# EAGLE design logic (EAGLE 9.6.2)
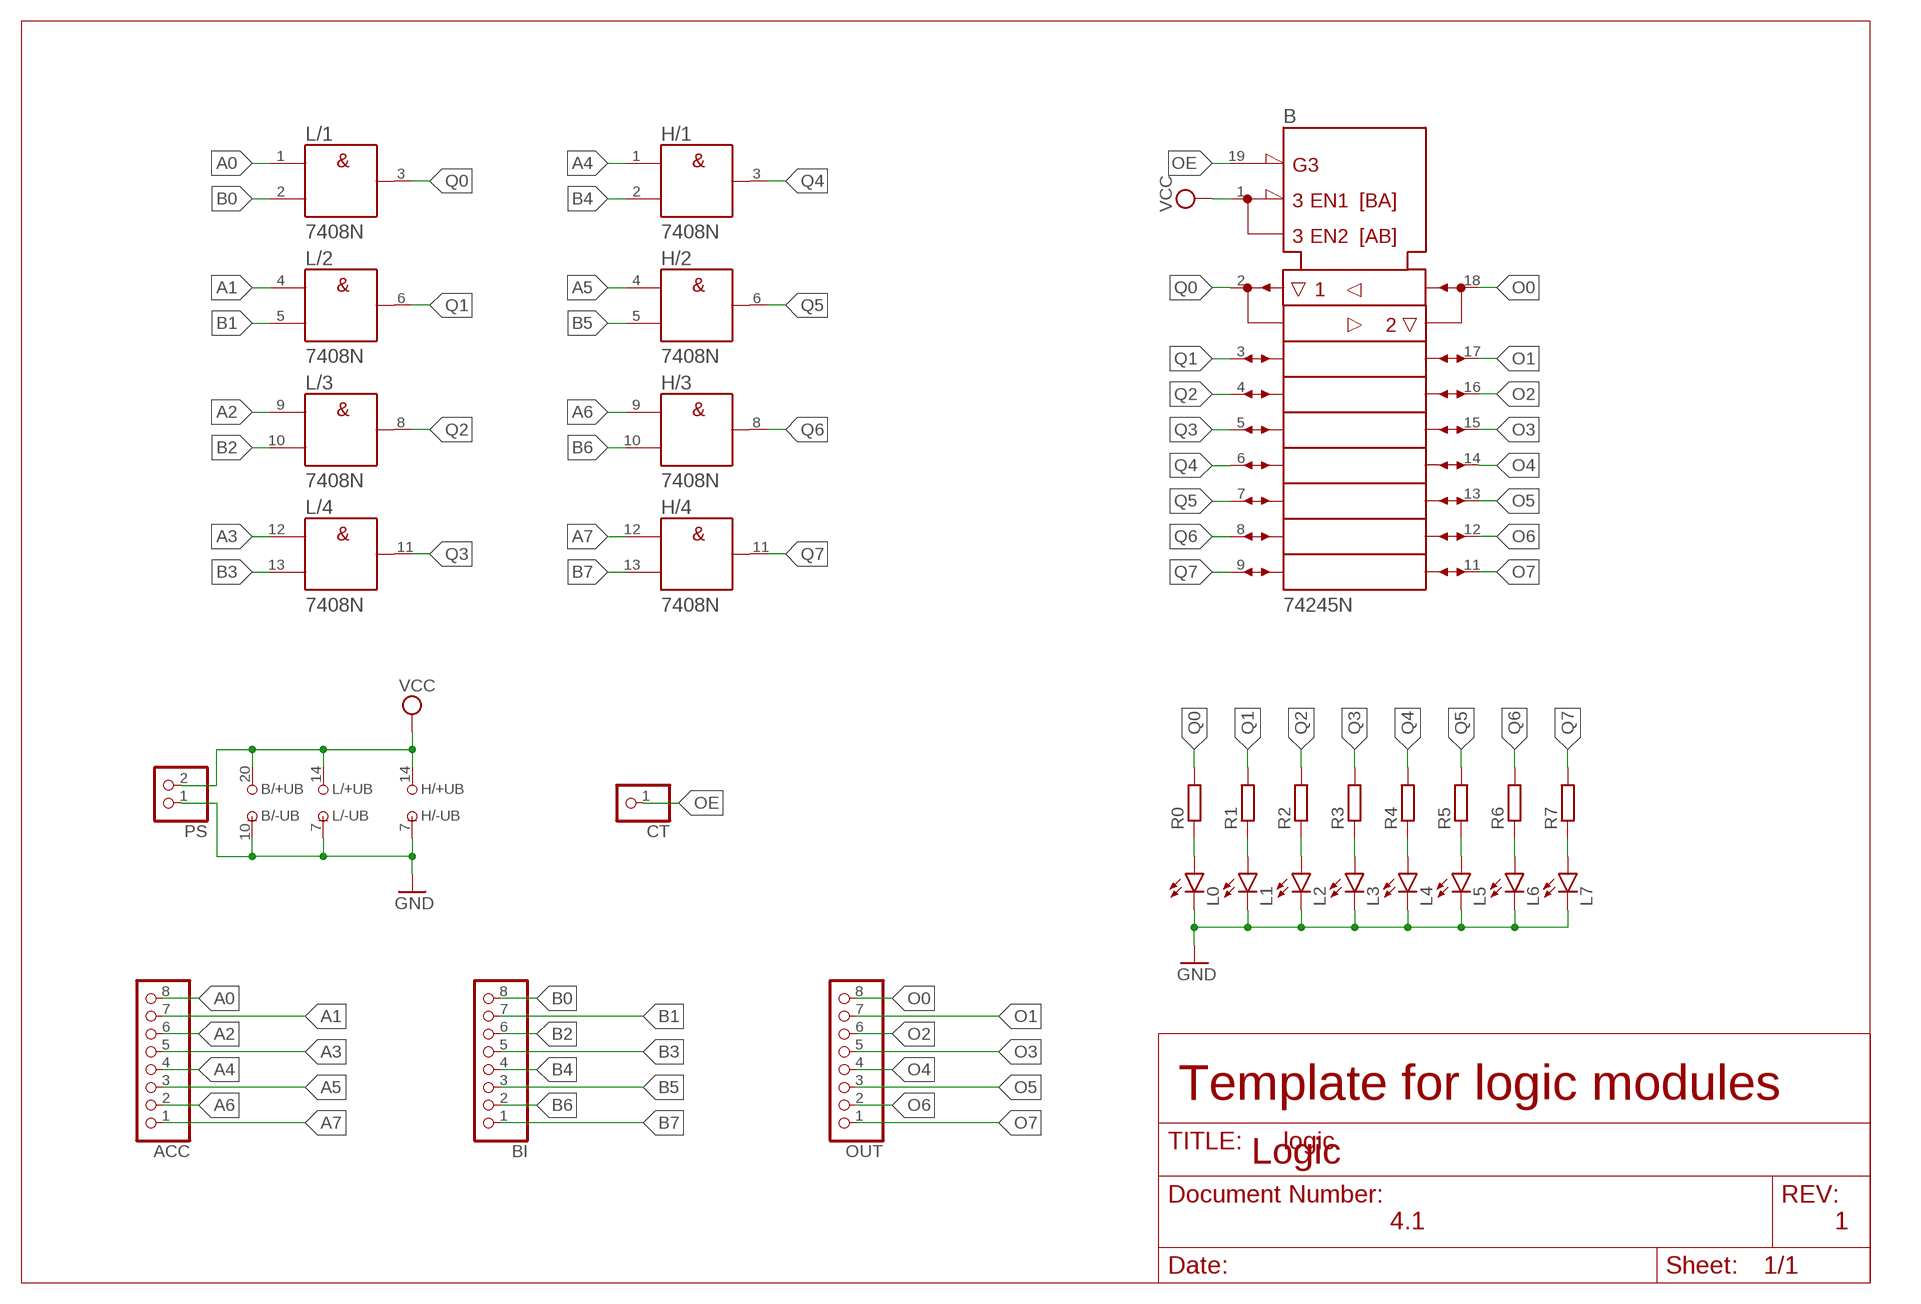
[diagram p0: schematic, sheet 1]

## Parts
ACC  PINHD-1X8  [1X08]
B  74245N  [DIL20]
BI  PINHD-1X8  [1X08]
CT  PINHD-1X1  [1X01]
H  7408N  [DIL14]
L  7408N  [DIL14]
L0  LED5MM  [LED5MM]
L1  LED5MM  [LED5MM]
L2  LED5MM  [LED5MM]
L3  LED5MM  [LED5MM]
L4  LED5MM  [LED5MM]
L5  LED5MM  [LED5MM]
L6  LED5MM  [LED5MM]
L7  LED5MM  [LED5MM]
OUT  PINHD-1X8  [1X08]
PS  PINHD-1X2  [1X02]
R0  R-EU_0204/7  [0204/7]
R1  R-EU_0204/7  [0204/7]
R2  R-EU_0204/7  [0204/7]
R3  R-EU_0204/7  [0204/7]
R4  R-EU_0204/7  [0204/7]
R5  R-EU_0204/7  [0204/7]
R6  R-EU_0204/7  [0204/7]
R7  R-EU_0204/7  [0204/7]

## Nets
A0: ACC.8 L.1(/1:A)
A1: ACC.7 L.4(/2:A)
A2: ACC.6 L.9(/3:A)
A3: ACC.5 L.12(/4:A)
A4: ACC.4 H.1(/1:A)
A5: ACC.3 H.4(/2:A)
A6: ACC.2 H.9(/3:A)
A7: ACC.1 H.12(/4:A)
B0: BI.8 L.2(/1:B)
B1: BI.7 L.5(/2:B)
B2: BI.6 L.10(/3:B)
B3: BI.5 L.13(/4:B)
B4: BI.4 H.2(/1:B)
B5: BI.3 H.5(/2:B)
B6: BI.2 H.10(/3:B)
B7: BI.1 H.13(/4:B)
GND: B.10(-UB) H.7(/-UB:-UB) L0.K(C) L1.K(C) L2.K(C) L3.K(C) L4.K(C) L5.K(C) L6.K(C) L7.K(C) L.7(/-UB:-UB) PS.1
N$1: L0.A R0.1
N$4: L1.A R1.1
N$7: L2.A R2.1
N$10: L3.A R3.1
N$13: L4.A R4.1
N$16: L5.A R5.1
N$19: L6.A R6.1
N$22: L7.A R7.1
O0: B.18(B1) OUT.8
O1: B.17(B2) OUT.7
O2: B.16(B3) OUT.6
O3: B.15(B4) OUT.5
O4: B.14(B5) OUT.4
O5: B.13(B6) OUT.3
O6: B.12(B7) OUT.2
O7: B.11(B8) OUT.1
OE: B.19(!G) CT.1
Q0: B.2(A1) L.3(/1:Y) R0.2
Q1: B.3(A2) L.6(/2:Y) R1.2
Q2: B.4(A3) L.8(/3:Y) R2.2
Q3: B.5(A4) L.11(/4:Y) R3.2
Q4: B.6(A5) H.3(/1:Y) R4.2
Q5: B.7(A6) H.6(/2:Y) R5.2
Q6: B.8(A7) H.8(/3:Y) R6.2
Q7: B.9(A8) H.11(/4:Y) R7.2
VCC: B.1(DIR) B.20(+UB) H.14(/+UB:+UB) L.14(/+UB:+UB) PS.2

## Notes on the sheet
- Template for logic modules
- Logic
- 4.1 | 1

## Library data of the parts
ACC BI OUT = pinhead:PINHD-1X8: PIN HEADER
B = 74ttl-din:74*245: Octal BUS TRANSCEIVER, 3-state
CT = pinhead:PINHD-1X1: PIN HEADER
H L = 74ttl-din:74*08: Quad 2-input AND gate
L0 L1-L7 = led:LED: LED OSRAM: - CHIPLED LG R971, LG N971, LY N971, LG Q971, LY Q971, LO R971, LY R971 LH N974, LH R974 LS Q976, LO Q976, LY Q976 LO Q996 - Hyper CHIPLED LW Q18S LB Q993, LB Q99A, LB R99A - SideLED LS A670, LO A670, LY A670, LG A670, LP A670 LB A673, LV A673, LT A673, LW A673 LH A674 LY A675 LS A676, LA A676, LO A676, LY A676, LW A676 LS A679, LY A679, LG A679 - Hyper Micro SIDELED® LS Y876, LA Y876, LO Y876, LY Y876 LT Y87S - SmartLED LW L88C, LW L88S LB L89C, LB L89S, LG L890 LS L89K, LO L89K, LY L89K LS L896, LA L896, LO L896, LY L896 - TOPLED LS T670, LO T670, LY T670, LG T670, LP T670 LSG T670, LSP T670, LSY T670, LOP T670, LYG T670 LG T671, LOG T671, LSG T671 LB T673, LV T673, LT T673, LW T673 LH T674 LS T676, LA T676, LO T676, LY T676, LB T676, LH T676, LSB T676, LW T676 LB T67C, LV T67C, LT T67C, LS T67K, LO T67K, LY T67K, LW E67C LS E67B, LA E67B, LO E67B, LY E67B, LB E67C, LV E67C, LT E67C LW T67C LS T679, LY T679, LG T679 LS T770, LO T770, LY T770, LG T770, LP T770 LB T773, LV T773, LT T773, LW T773 LH T774 LS E675, LA E675, LY E675, LS T675 LS T776, LA T776, LO T776, LY T776, LB T776 LHGB T686 LT T68C, LB T68C - Hyper Mini TOPLED® LB M676 - Mini TOPLED Santana® LG M470 LS M47K, LO M47K, LY M47K Source: http://www.osram.convergy.de LUXEON: - LUMILED® LXK2-PW12-R00, LXK2-PW12-S00, LXK2-PW14-U00, LXK2-PW14-V00 LXK2-PM12-R00, LXK2-PM12-S00, LXK2-PM14-U00 LXK2-PE12-Q00, LXK2-PE12-R00, LXK2-PE12-S00, LXK2-PE14-T00, LXK2-PE14-U00 LXK2-PB12-K00, LXK2-PB12-L00, LXK2-PB12-M00, LXK2-PB14-N00, LXK2-PB14-P00, LXK2-PB14-Q00 LXK2-PR12-L00, LXK2-PR12-M00, LXK2-PR14-Q00, LXK2-PR14-R00 LXK2-PD12-Q00, LXK2-PD12-R00, LXK2-PD12-S00 LXK2-PH12-R00, LXK2-PH12-S00 LXK2-PL12-P00, LXK2-PL12-Q00, LXK2-PL12-R00 Source: www.luxeon.com KINGBRIGHT: KA-3528ASYC Source: www.kingbright.com
PS = pinhead:PINHD-1X2: PIN HEADER
R0 R1-R7 = rcl:R-EU_: RESISTOR, European symbol; SPICEPREFIX: R

## Board
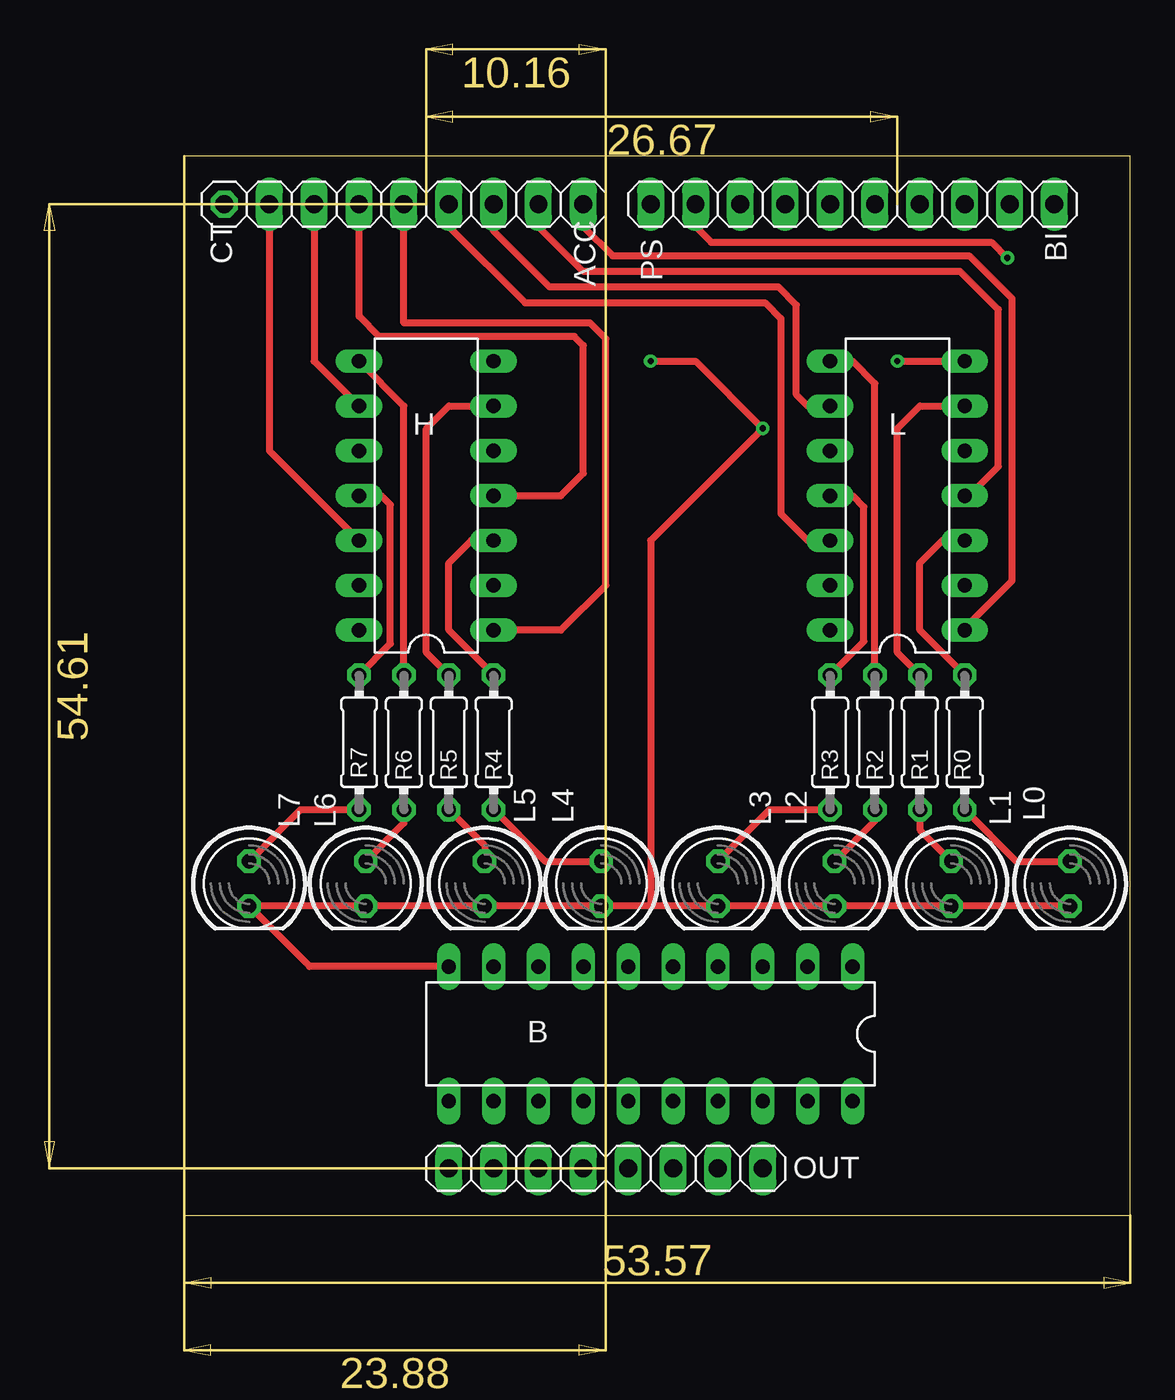
[diagram p1: board, top side]
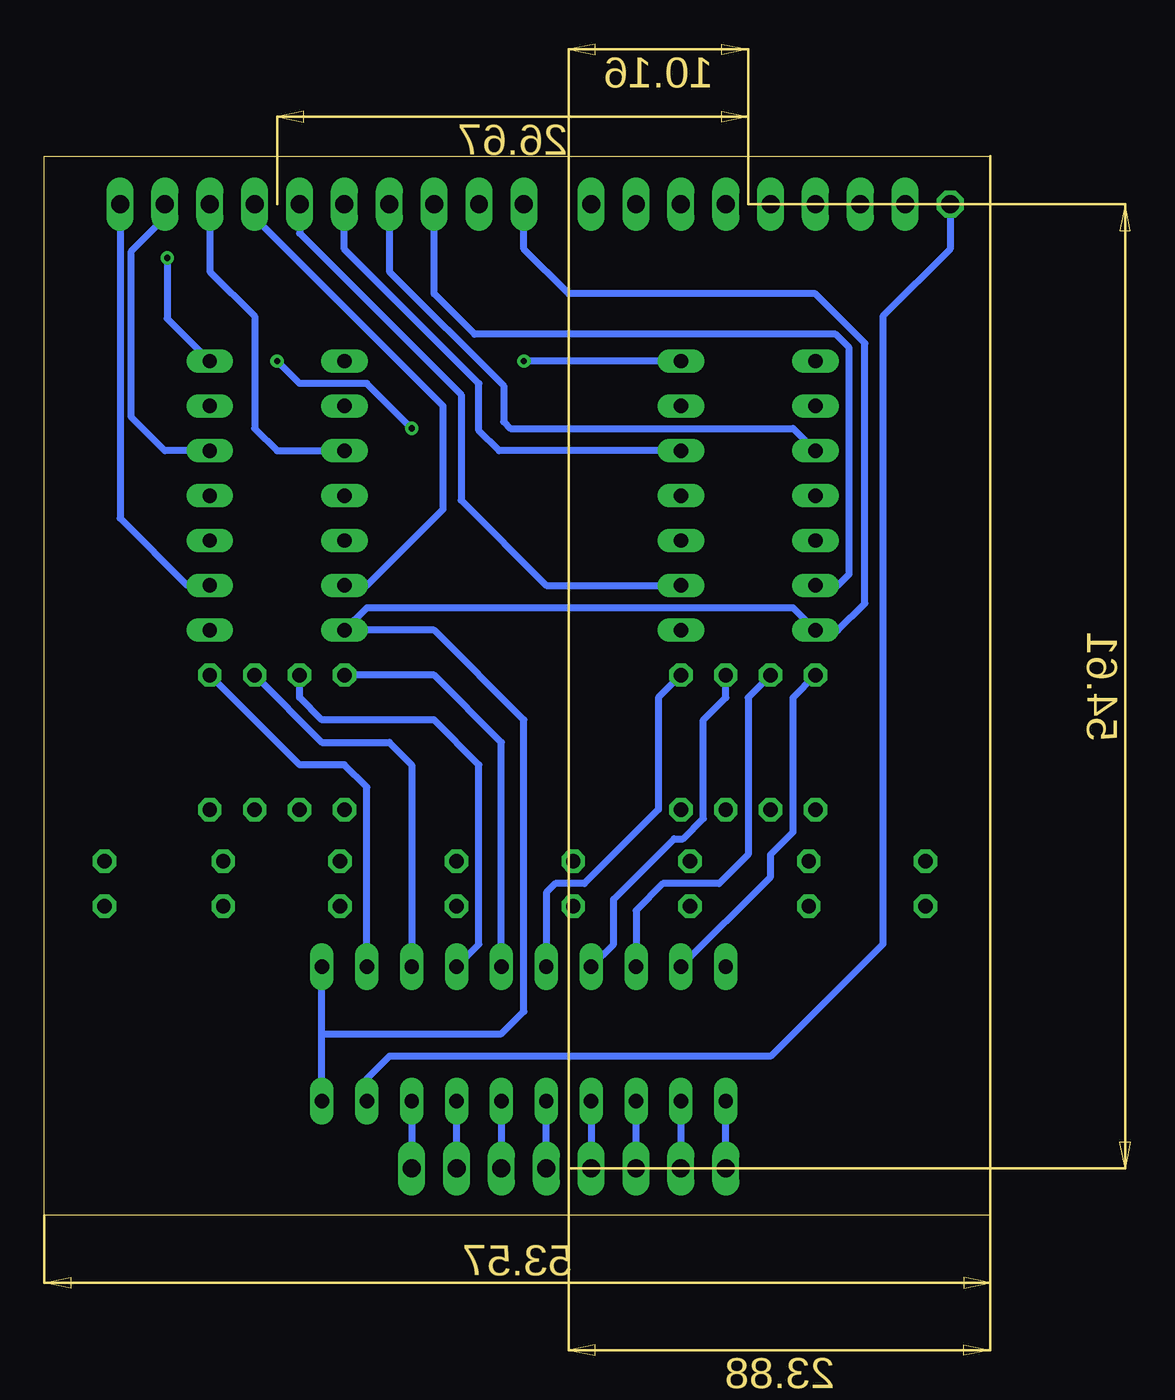
[diagram p2: board, bottom side, seen from below]

Size 53.57 x 59.99 mm. Coordinates in mm from the lower left corner, seen from the top.
Outline: 0,0 53.57,0 53.57,59.99 0,59.99 0,0
Copper layers (1*16): Top 0.035mm / dielectric 1.5mm / Bottom 0.035mm
Design rules "default": minimum track width 6mil, minimum drill 0.35mm, track to track 6mil, track to pad 6mil, pad to pad 6mil, via to via 6mil, smd to smd 6mil, copper to edge 40mil, drill to drill 6mil, minimum pad ring 10mil, minimum via ring 8mil, stop-mask expansion 4mil, vias tented up to drill 0mil, thermal gap 10mil

### Footprints (pad centres in the part's own frame; a part is rotated, then mirrored left to right if it is on the bottom)
1X08 = drill 1.016 long: 1 -8.89,0; 2 -6.35,0; 3 -3.81,0; 4 -1.27,0; 5 1.27,0; 6 3.81,0; 7 6.35,0; 8 8.89,0
DIL20 = drill 0.813 long: 1 -11.43,-3.81; 2 -8.89,-3.81; 3 -6.35,-3.81; 4 -3.81,-3.81; 5 -1.27,-3.81; 6 1.27,-3.81; 7 3.81,-3.81; 8 6.35,-3.81; 9 8.89,-3.81; 10 11.43,-3.81; 11 11.43,3.81; 12 8.89,3.81; 13 6.35,3.81; 14 3.81,3.81; 15 1.27,3.81; 16 -1.27,3.81; 17 -3.81,3.81; 18 -6.35,3.81; 19 -8.89,3.81; 20 -11.43,3.81
1X01 = drill 1.016 octagon: 1 0,0
DIL14 = drill 0.813 long: 1 -7.62,-3.81; 2 -5.08,-3.81; 3 -2.54,-3.81; 4 0,-3.81; 5 2.54,-3.81; 6 5.08,-3.81; 7 7.62,-3.81; 8 7.62,3.81; 9 5.08,3.81; 10 2.54,3.81; 11 0,3.81; 12 -2.54,3.81; 13 -5.08,3.81; 14 -7.62,3.81
LED5MM = drill 0.813 octagon: A -1.27,0; K 1.27,0
1X02 = drill 1.016 long: 1 -1.27,0; 2 1.27,0
0204/7 = drill 0.813 octagon: 1 -3.81,0; 2 3.81,0

### Placement (x,y rotation side)
ACC  13.72,57.28 0 top
B  26.42,10.29 180 top
BI  40.39,57.28 0 top
CT  2.29,57.28 0 top
H  13.72,40.77 90 top
L  40.39,40.77 90 top
L0  50.16,18.8 270 top
L1  43.43,18.8 270 top
L2  36.83,18.8 270 top
L3  30.23,18.8 270 top
L4  23.62,18.8 270 top
L5  17.02,18.8 270 top
L6  10.29,18.8 270 top
L7  3.68,18.8 270 top
OUT  23.88,2.67 0 top
PS  27.69,57.28 180 top
R0  44.2,26.8 90 top
R1  41.66,26.8 90 top
R2  39.12,26.8 90 top
R3  36.58,26.8 90 top
R4  17.53,26.8 90 top
R5  14.99,26.8 90 top
R6  12.45,26.8 90 top
R7  9.91,26.8 90 top

### Tracks (layer width: path | path; a pad name or v marks a point on that pad's centre or on a via)
A0
  Top 0.4: ACC.8 22.61,56.01 24.26,54.36 44.45,54.36 46.86,51.94 46.86,35.94 44.2,33.27 L.1
A1
  Top 0.4: L.4 44.45,40.77 46.1,42.42 46.1,51.31 43.94,53.47 22.61,53.47 20.07,56.01 ACC.7
A2
  Top 0.4: L.9 35.31,45.85 34.67,46.48 34.67,51.56 33.66,52.58 20.7,52.58 17.53,55.75 ACC.6
A3
  Top 0.4: ACC.5 14.99,56.01 19.3,51.69 32.89,51.69 33.78,50.8 33.78,39.75 35.31,38.23 L.12
A4
  Top 0.4: H.1 21.34,33.15 23.88,35.69 23.88,49.66 22.99,50.55 12.45,50.55 ACC.4
A5
  Top 0.4: H.4 21.34,40.77 22.61,42.04 22.61,49.28 22.1,49.78 11.05,49.78 9.91,50.93 ACC.3
A6
  Top 0.4: H.9 7.37,48.39 ACC.2
A7
  Top 0.4: H.12 4.83,43.31 ACC.1
B0
  Bottom 0.4: BI.8 49.28,39.5 45.47,35.69 L.2
B1
  Bottom 0.4: L.5 46.74,43.31 48.64,45.21 48.64,54.61 46.74,56.52 BI.7
B2
  Bottom 0.4: BI.6 44.2,53.47 41.66,50.93 41.66,44.58 40.39,43.31 L.10
B3
  Bottom 0.4: L.13 35.31,35.69 30.99,40.01 30.99,45.85 41.66,56.52 BI.5
B4
  Bottom 0.4: BI.4 39.12,55.63 29.97,46.48 29.97,40.51 25.15,35.69 H.2
B5
  Bottom 0.4: H.5 27.81,43.31 28.96,44.45 28.96,47.12 36.58,54.74 BI.3
B6
  Bottom 0.4: BI.2 34.04,53.47 27.56,46.99 27.56,44.96 27.18,44.58 11.18,44.58 H.10
B7
  Bottom 0.4: H.13 8.64,35.69 8,36.32 8,49.15 8.76,49.91 29.21,49.91 31.5,52.2 BI.1
GND  (via drill 0.35)
  Top 0.4: L0.K L1.K L2.K L3.K 26.42,17.53 | 26.42,17.53 L4.K L5.K L6.K L7.K 7.11,14.1 B.10 | v26.42,48.39 28.96,48.39 v32.77,44.58 26.42,38.23 26.42,17.53 | v40.39,48.39 L.7 | PS.1 28.96,56.01 29.84,55.12 45.72,55.12 v46.61,54.23
  Bottom 0.4: H.7 v26.42,48.39 | v32.77,44.58 35.31,47.12 39.12,47.12 v40.39,48.39 | v46.61,54.23 46.61,50.8 L.7
N$1
  Top 0.4: R0.1 47.12,20.07 L0.A
N$4
  Top 0.4: R1.1 41.66,21.84 L1.A
N$7
  Top 0.4: L2.A 39.12,22.35 R2.1
N$10
  Top 0.4: L3.A 33.15,22.99 R3.1
N$13
  Top 0.4: R4.1 20.45,20.07 L4.A
N$16
  Top 0.4: R5.1 17.02,20.95 L5.A
N$19
  Top 0.4: L6.A 12.45,22.23 R6.1
N$22
  Top 0.4: L7.A 6.6,22.99 R7.1
O0
  Bottom 0.4: B.18 OUT.8
O1
  Bottom 0.4: OUT.7 B.17
O2
  Bottom 0.4: B.16 OUT.6
O3
  Bottom 0.4: OUT.5 B.15
O4
  Bottom 0.4: B.14 OUT.4
O5
  Bottom 0.4: OUT.3 B.13
O6
  Bottom 0.4: B.12 OUT.2
O7
  Bottom 0.4: OUT.1 B.11
OE
  Bottom 0.4: CT.1 2.29,54.74 6.1,50.93 6.1,15.37 12.45,9.02 34.04,9.02 35.31,7.75 B.19
Q0
  Top 0.4: R0.2 41.66,33.15 41.66,36.96 42.93,38.23 L.3
  Bottom 0.4: B.2 35.31,24.26 36.58,25.53 39.12,25.53 R0.2
Q1
  Top 0.4: R1.2 40.39,31.88 40.39,44.58 41.66,45.85 L.6
  Bottom 0.4: R1.2 37.85,26.8 34.04,26.8 32.77,25.53 B.3
Q2
  Top 0.4: R2.2 39.12,47.12 37.85,48.39 L.8
  Bottom 0.4: B.4 28.96,15.37 28.96,25.53 31.5,28.07 37.85,28.07 39.12,29.34 R2.2
Q3
  Top 0.4: L.11 37.85,40.77 38.48,40.13 38.48,32.51 R3.2
  Bottom 0.4: B.5 27.69,26.8 31.5,30.61 R3.2
Q4
  Top 0.4: R4.2 14.99,33.15 14.99,36.96 16.26,38.23 H.3
  Bottom 0.4: R4.2 18.8,29.34 18.8,22.99 22.99,18.8 24.64,18.8 25.15,18.29 B.6
Q5
  Top 0.4: R5.2 13.72,31.88 13.72,44.58 14.99,45.85 H.6
  Bottom 0.4: B.7 21.34,15.37 21.34,17.91 17.91,21.34 17.4,21.34 16.26,22.48 16.26,28.07 14.99,29.34 R5.2
Q6
  Top 0.4: H.8 12.45,45.85 R6.2
  Bottom 0.4: R6.2 13.72,29.34 13.72,20.45 15.37,18.8 18.54,18.8 20.07,17.27 B.8
Q7
  Top 0.4: H.11 11.18,40.77 11.68,40.26 11.68,32.38 R7.2
  Bottom 0.4: R7.2 11.18,29.34 11.18,21.72 12.45,20.45 12.45,19.18 B.9
VCC
  Bottom 0.4: B.20 37.85,10.29 | 37.85,10.29 B.1 | 37.85,10.29 27.69,10.29 26.42,11.56 26.42,28.07 31.5,33.15 L.14 35.31,34.42 11.18,34.42 H.14 8.64,33.15 7.11,34.67 7.11,49.4 9.91,52.2 23.88,52.2 26.42,54.74 PS.2